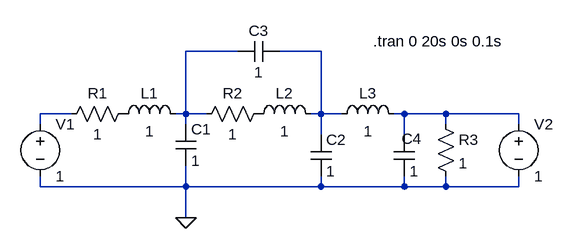
[diagram p0: schematic P1a.asc]
P1a.asc, the LTspice schematic file:
Version 4
SHEET 1 880 680
WIRE 176 -16 96 -16
WIRE 304 -16 240 -16
WIRE -80 80 -128 80
WIRE 96 80 96 -16
WIRE 96 80 80 80
WIRE 128 80 96 80
WIRE 304 80 304 -16
WIRE 304 80 288 80
WIRE 336 80 304 80
WIRE 432 80 416 80
WIRE 496 80 432 80
WIRE 608 80 496 80
WIRE -128 96 -128 80
WIRE 96 96 96 80
WIRE 496 96 496 80
WIRE 608 96 608 80
WIRE 304 112 304 80
WIRE 432 112 432 80
WIRE -128 192 -128 176
WIRE 96 192 96 160
WIRE 96 192 -128 192
WIRE 304 192 304 176
WIRE 304 192 96 192
WIRE 432 192 432 176
WIRE 432 192 304 192
WIRE 496 192 496 176
WIRE 496 192 432 192
WIRE 608 192 608 176
WIRE 608 192 496 192
WIRE 96 240 96 192
FLAG 96 240 0
SYMBOL cap 80 96 R0
SYMATTR InstName C1
SYMATTR Value 1
SYMBOL cap 288 112 R0
SYMATTR InstName C2
SYMATTR Value 1
SYMBOL cap 240 -32 R90
WINDOW 0 0 32 VBottom 2
WINDOW 3 32 32 VTop 2
SYMATTR InstName C3
SYMATTR Value 1
SYMBOL cap 416 112 R0
WINDOW 0 12 6 Left 2
SYMATTR InstName C4
SYMATTR Value 1
SYMBOL ind -16 96 R270
WINDOW 0 32 56 VTop 2
WINDOW 3 5 56 VBottom 2
SYMATTR InstName L1
SYMATTR Value 1
SYMBOL ind 192 96 R270
WINDOW 0 32 56 VTop 2
WINDOW 3 5 56 VBottom 2
SYMATTR InstName L2
SYMATTR Value 1
SYMBOL ind 320 96 R270
WINDOW 0 32 56 VTop 2
WINDOW 3 5 56 VBottom 2
SYMATTR InstName L3
SYMATTR Value 1
SYMBOL res 16 64 R90
WINDOW 0 0 56 VBottom 2
WINDOW 3 32 56 VTop 2
SYMATTR InstName R1
SYMATTR Value 1
SYMBOL res 224 64 R90
WINDOW 0 0 56 VBottom 2
WINDOW 3 32 56 VTop 2
SYMATTR InstName R2
SYMATTR Value 1
SYMBOL res 480 80 R0
SYMATTR InstName R3
SYMATTR Value 1
SYMBOL voltage -128 80 R0
WINDOW 123 0 0 Left 0
WINDOW 39 24 124 Left 2
SYMATTR InstName V1
SYMATTR Value 1
SYMBOL voltage 608 80 R0
WINDOW 123 0 0 Left 0
WINDOW 39 24 124 Left 2
SYMATTR InstName V2
SYMATTR Value 1
TEXT 384 -32 Left 2 !.tran 0 20s 0s 0.1s

The netlist it stands for:
* P1a.asc
C1 N001 0 1
C2 N002 0 1
C3 N002 N001 1
C4 N004 0 1
L1 P001 N001 1
L2 P002 N002 1
L3 N002 N004 1
R1 P001 N003 1
R2 P002 N001 1
R3 N004 0 1
V1 N003 0 1
V2 N004 0 1
.tran 0 20s 0s 0.1s
.backanno
.end